# EAGLE design mpu-9150_breakout (EAGLE 6.5.0)
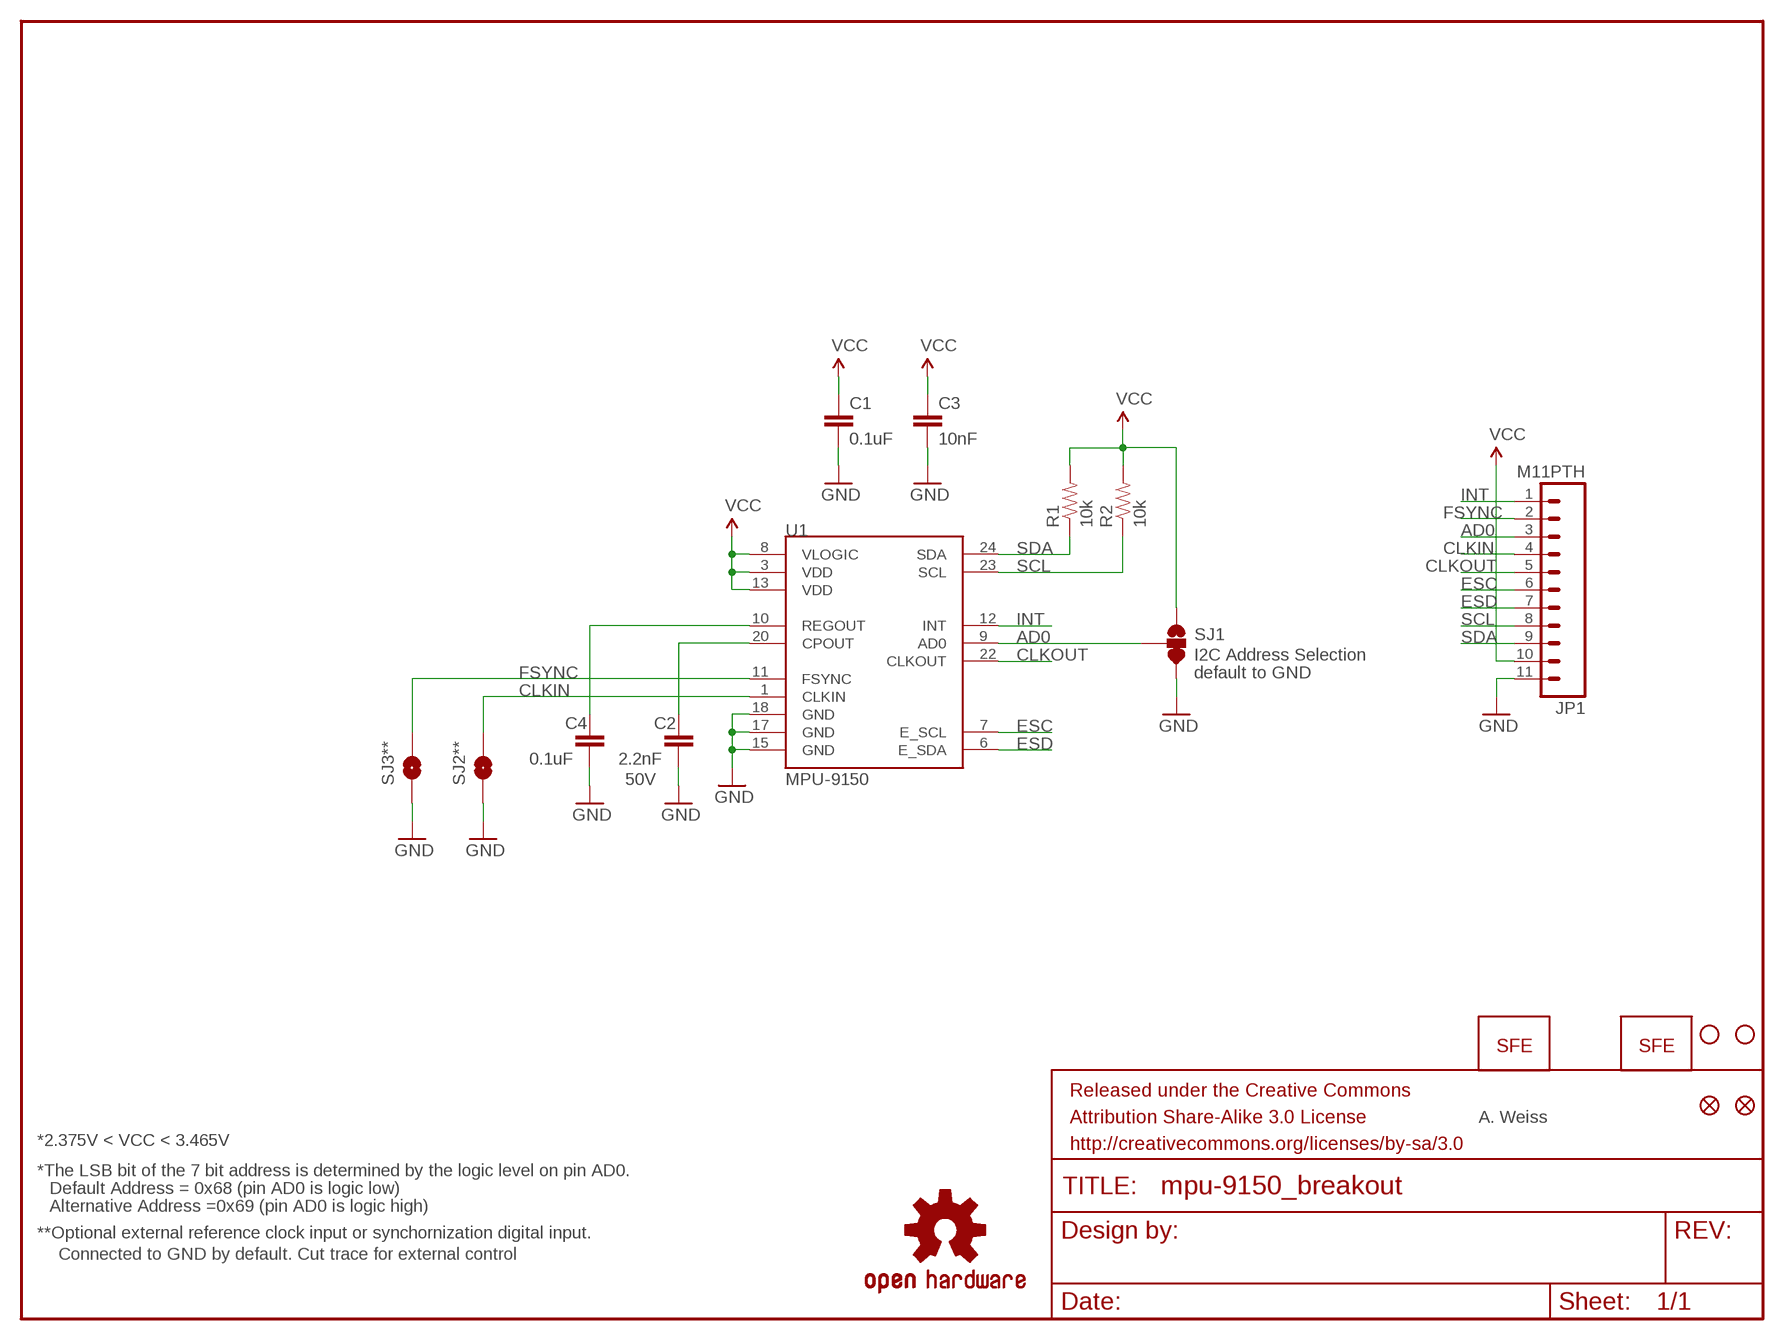
[diagram p0: schematic, sheet 1]

## Parts
C1  0.1uF  CAP0402-CAP  [0402-CAP]
C2  2.2nF  CAP0402-CAP  [0402-CAP]
C3  10nF  CAP0402-CAP  [0402-CAP]
C4  0.1uF  CAP0402-CAP  [0402-CAP]
JP1  M11PTH  [1X11]
JP2  STAND-OFF  [STAND-OFF]
JP3  STAND-OFF  [STAND-OFF]
JP4  LOGO-SFENW2  [SFE-NEW-WEB]
JP6  LOGO-SFESK  [SFE-LOGO-FLAME]
JP7  FIDUCIALUFIDUCIAL  [MICRO-FIDUCIAL]
JP8  FIDUCIALUFIDUCIAL  [MICRO-FIDUCIAL]
R1  10k  RESISTOR0402-RES  [0402-RES]
R2  10k  RESISTOR0402-RES  [0402-RES]
SJ1  SOLDERJUMPER_2WAYPASTE2&3  [SJ_3_PASTE2&3]
SJ2**  SOLDERJUMPERTRACE  [SJ_2S-TRACE]
SJ3**  SOLDERJUMPERTRACE  [SJ_2S-TRACE]
U1  MPU-9150  MPU-9150QFN-24-NP  [QFN-24-NP]
U$1  OSHW-LOGOS  [OSHW-LOGO-S]

## Nets
AD0: JP1.3 SJ1.2 U1.9(AD0)
CLKIN: JP1.4 SJ2**.2 U1.1(CLKIN)
CLKOUT: JP1.5 U1.22(CLKOUT)
ESC: JP1.6 U1.7(E_SCL)
ESD: JP1.7 U1.6(E_SDA)
FSYNC: JP1.2 SJ3**.2 U1.11(FSYNC)
GND: C1.2 C2.2 C3.2 C4.2 JP1.11 SJ1.3 SJ2**.1 SJ3**.1 U1.15(GND) U1.17(GND) U1.18(GND)
INT: JP1.1 U1.12(INT)
N$1: C2.1 U1.20(CPOUT)
N$2: C4.1 U1.10(REGOUT)
SCL: JP1.8 R2.1 U1.23(SCL)
SDA: JP1.9 R1.1 U1.24(SDA)
VCC: C1.1 C3.1 JP1.10 R1.2 R2.2 SJ1.1 U1.3(VDD) U1.8(VLOGIC) U1.13(VDD)

## Notes on the sheet
- I2C Address Selection
- default to GND
- 50V
- A. Weiss
- *2.375V < VCC < 3.465V
- *The LSB bit of the 7 bit address is determined by the logic level on pin AD0.
- Default Address = 0x68 (pin AD0 is logic low)
- Alternative Address =0x69 (pin AD0 is logic high)
- **Optional external reference clock input or synchornization digital input.
- Connected to GND by default. Cut trace for external control

## Library data of the parts
C1-C4 = SparkFun-Passives:CAP: Capacitor Standard 0603 ceramic capacitor, and 0.1" leaded capacitor.
JP1 = SparkFun-Connectors:M11: Header 11 Standard 11-pin 0.1" header. Use with straight break away headers (SKU : PRT-00116), right angle break away headers (PRT-00553), swiss pins (PRT-00743), machine pins (PRT-00117), and female headers (PRT-00115).
JP2 JP3 = SparkFun-Electromechanical:STAND-OFF: #4 Stand Off This is the mechanical footprint for a #4 phillips button head screw. Use the keepout ring to avoid running the screw head into surrounding components. SKU : PRT-00447
JP4 JP6 = SparkFun-Aesthetics:LOGO-SFE: Spark Fun Electronics PCB Logo This is the standard Spark Fun Electronics PCB logo.
JP7 JP8 = SparkFun:FIDUCIAL: Fiducial Alignment Points Various fiducial points for machine vision alignment.
R1 R2 = SparkFun-Passives:RESISTOR: Resistor Basic schematic elements and footprints for 0603, 1206, and PTH resistors.
SJ1 = SparkFun-Passives:SOLDERJUMPER_2WAY: Solder Jumper 2 way solder jumper
SJ2** SJ3** = SparkFun-Passives:SOLDERJUMPER: Solder Jumper Standard SMD solder jumper. Used to automate production. Two varients : Normally Open and Normally Closed are the same, but have different paste layers. NC will have a large amount of paste and should jumper during reflow.
U1 = SparkFun-Sensors:MPU-9150: 9DOF (3mag, 3accel, 3rotat). I2C interface.
U$1 = SparkFun-Aesthetics:OSHW-LOGO: Open Source Hardware Logo This logo indicates the piece of hardware it is found on incorporates a OSHW license and/or adheres to the definition of open source hardware found here: http://freedomdefined.org/OSHW

## Board
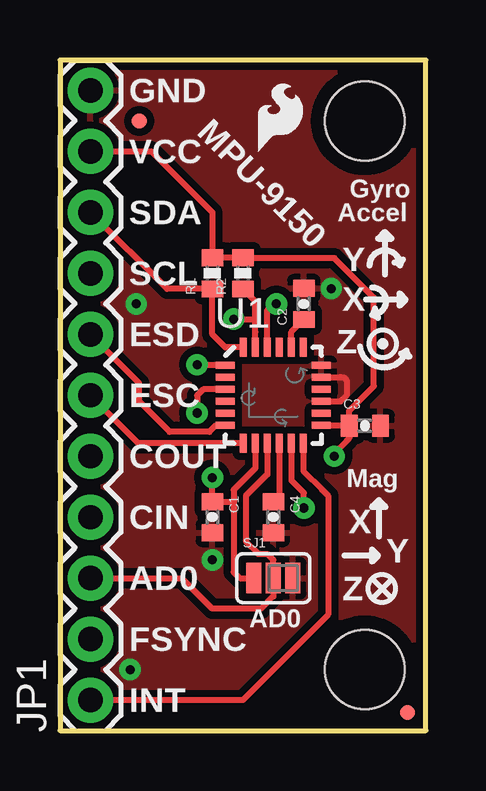
[diagram p1: board, top side]
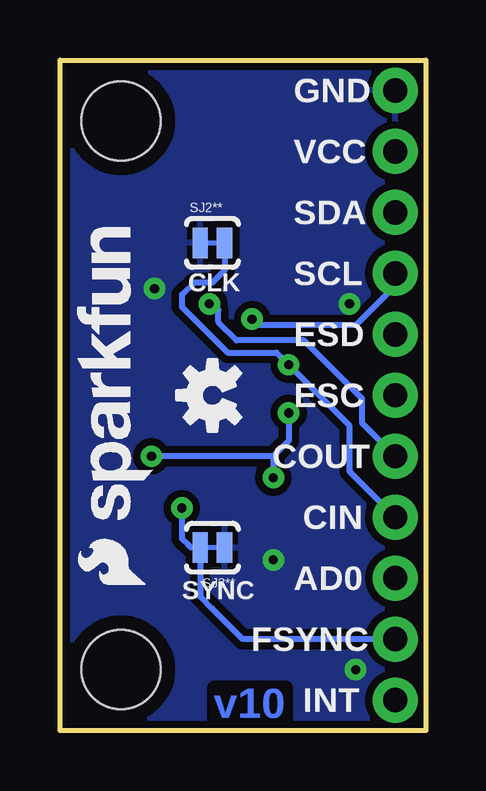
[diagram p2: board, bottom side, seen from below]

Size 15.24 x 27.94 mm. Coordinates in mm from the lower left corner, seen from the top.
Outline: 0,0 15.24,0 15.24,27.94 0,27.94 0,0
Copper layers (1*16): Top 0.035559375mm / dielectric 1.501140625mm / Bottom 0.035559375mm
Design rules: minimum track width 8mil, minimum drill 15mil, track to track 8mil, track to pad 8mil, pad to pad 8mil, via to via 8mil, smd to smd 8mil, copper to edge 10mil, drill to drill 8mil, minimum pad ring 12mil, minimum via ring 10mil, stop-mask expansion 4mil, vias tented up to drill 20mil, thermal gap 10mil

### Footprints (pad centres in the part's own frame; a part is rotated, then mirrored left to right if it is on the bottom)
0402-CAP = smd 0.7 x 0.9: 1 -0.65,0; 2 0.65,0
1X11 = drill 1.016 pad 1.88: 1 0,0; 2 2.54,0; 3 5.08,0; 4 7.62,0; 5 10.16,0; 6 12.7,0; 7 15.24,0; 8 17.78,0; 9 20.32,0; 10 22.86,0; 11 25.4,0
STAND-OFF = hole 3.302: 0,0
MICRO-FIDUCIAL = smd 0.635 x 0.635: 1 0,0
0402-RES = smd 0.7 x 0.9: 1 -0.65,0; 2 0.65,0
SJ_3_PASTE2&3 = smd 0.635 x 1.27: 1 -0.813,0; 2 0,0; 3 0.813,0
SJ_2S-TRACE = smd 0.635 x 1.27: 1 -0.508,0; 2 0.508,0
QFN-24-NP = smd 0.8 x 0.3: 1 -2,1.25; 2 -2,0.75; 3 -2,0.25; 4 -2,-0.25; 5 -2,-0.75; 6 -2,-1.25; 13 2,-1.25; 14 2,-0.75; 15 2,-0.25; 16 2,0.25; 17 2,0.75; 18 2,1.25 | smd 0.3 x 0.8: 7 -1.25,-2; 8 -0.75,-2; 9 -0.25,-2; 10 0.25,-2; 11 0.75,-2; 12 1.25,-2; 19 1.25,2; 20 0.75,2; 21 0.25,2; 22 -0.25,2; 23 -0.75,2; 24 -1.25,2

### Placement (x,y rotation side)
C1  6.35,8.89 270 top
C2  10.16,17.78 90 top
C3  12.7,12.7 0 top
C4  8.89,8.89 270 top
JP1  1.27,1.27 90 top
JP2  12.7,25.4 0 top
JP3  12.7,2.54 0 top
JP4  11.38,8.78 90 bottom
JP5  LOGO-SFESK  [SFE-LOGO-FLAME]  8.26,24.13 0 top
JP6  11.68,6.1 90 bottom
JP7  3.3,25.4 0 top
JP8  14.48,0.76 0 top
R1  6.35,19.05 90 top
R2  7.62,19.05 90 top
SJ1  8.89,6.35 0 top
SJ2**  8.89,20.32 0 bottom
SJ3**  8.89,7.62 180 bottom
U1  8.89,13.97 0 top
U$1  8.89,13.97 90 bottom

### Tracks (layer width: path | path; a pad name or v marks a point on that pad's centre or on a via)
AD0
  Top 0.254: U1.9 8.64,10.67 7.75,9.78 7.75,7.87 8.26,7.37 8.64,7.37 8.76,7.24 8.89,7.11 SJ1.2 8.89,5.59 8.38,5.08 6.35,5.08 5.08,6.35 JP1.3
CLKIN  (via drill 0.38)
  Top 0.254: U1.1 5.74,15.22 v5.71,15.24
  Bottom 0.254: SJ2**.2 8.38,19.18 8.89,18.67 9.4,18.67 9.65,18.67 10.16,18.16 10.16,17.65 9.78,17.27 8.26,15.75 6.22,15.75 v5.71,15.24 3.17,12.7 3.17,10.79 3.05,10.67 JP1.4
CLKOUT  (via drill 0.38)
  Top 0.254: U1.22 8.64,17.53 v9.02,17.78
  Bottom 0.254: v9.02,17.78 8.64,17.53 8.64,17.02 7.88,16.26 5.08,16.26 3.81,14.99 2.67,13.84 2.67,12.83 JP1.5
ESC
  Top 0.254: U1.7 3.27,11.97 JP1.6
ESD
  Top 0.254: U1.6 6.5,12.72 6.22,12.45 4.57,12.45 3.3,13.72 3.3,14.48 JP1.7
FSYNC  (via drill 0.38)
  Top 0.254: U1.11 9.64,10.43 10.03,10.03 10.16,9.91 v10.16,9.27
  Bottom 0.254: v10.16,9.27 10.16,8 9.91,7.75 9.78,7.62 SJ3**.2 9.4,5.59 8.89,5.08 7.62,3.81 JP1.2
GND  (via drill 0.38)
  Top 0.254: U1.15 11.68,13.72 11.94,13.97 11.94,14.61 11.82,14.72 U1.17 11.67,14.72 11.68,14.73
  other vias: 11.3,18.41 3.17,17.78 2.92,2.54 6.35,7.11
  pour Bottom (isolate 0.305): 0,27.94 0,0 15.24,0 15.24,27.94
  pour Top (isolate 0.305): 0,27.94 0,0 15.24,0 15.24,27.94
INT
  Top 0.254: U1.12 10.14,10.81 10.92,10.03 11.18,9.78 11.18,4.83 7.62,1.27 JP1.1
N$1
  Top 0.254: U1.20 9.64,16.61 C2.1
N$2
  Top 0.254: U1.10 9.14,9.79 C4.1
SCL  (via drill 0.38)
  Top 0.254: U1.23 8.14,16.61 8.14,17.14 | 8.14,17.14 8.14,17.88 R2.1 | v7.24,17.14 8.14,17.14
  Bottom 0.254: JP1.8 1.27,18.54 2.92,16.89 6.99,16.89 v7.24,17.14
SDA
  Top 0.254: U1.24 6.89,15.97 6.35,16.51 R1.1 4.46,18.4 JP1.9
VCC  (via drill 0.38)
  Top 0.254: JP1.10 3.81,24.13 6.35,21.59 R1.2 R2.2 7.63,19.68 11.43,19.68 13.08,18.03 13.08,14.35 12.32,13.59 12.05,13.32 C3.1 | U1.8 8.14,10.93 7.24,10.03 7.24,9.53 | 7.24,9.53 7.24,6.6 7.49,6.35 SJ1.1 | v11.43,11.43 11.43,11.56 11.94,12.06 11.95,12.08 12.05,12.18 C3.1 | v6.35,10.54 C1.1 7.22,9.54 7.24,9.53 | U1.3 5.96,14.22 5.71,13.97 v5.71,13.23 | U1.13 12.03,12.72 C3.1
  Bottom 0.254: 6.35,11.43 5.73,12.05 5.71,12.06 v5.71,13.23 | 6.35,11.43 v11.43,11.43 | 6.35,11.43 v6.35,10.54

### Text on the board
Bottom: v10
tPlace: GND | VCC | Gyro | SDA | MPU-9150 | Accel | SCL | Y | X | ESD | Z | ESC | COUT | Mag | CIN | X | Y | AD0 | Z | AD0 | FSYNC | INT
bPlace: GND | VCC | SDA | SCL | CLK | ESD | ESC | COUT | CIN | AD0 | SYNC | FSYNC | INT